# Altium schematic sheet Sheet1.SchDoc
size A4; SheetNumber: 1; SheetTotal: 2
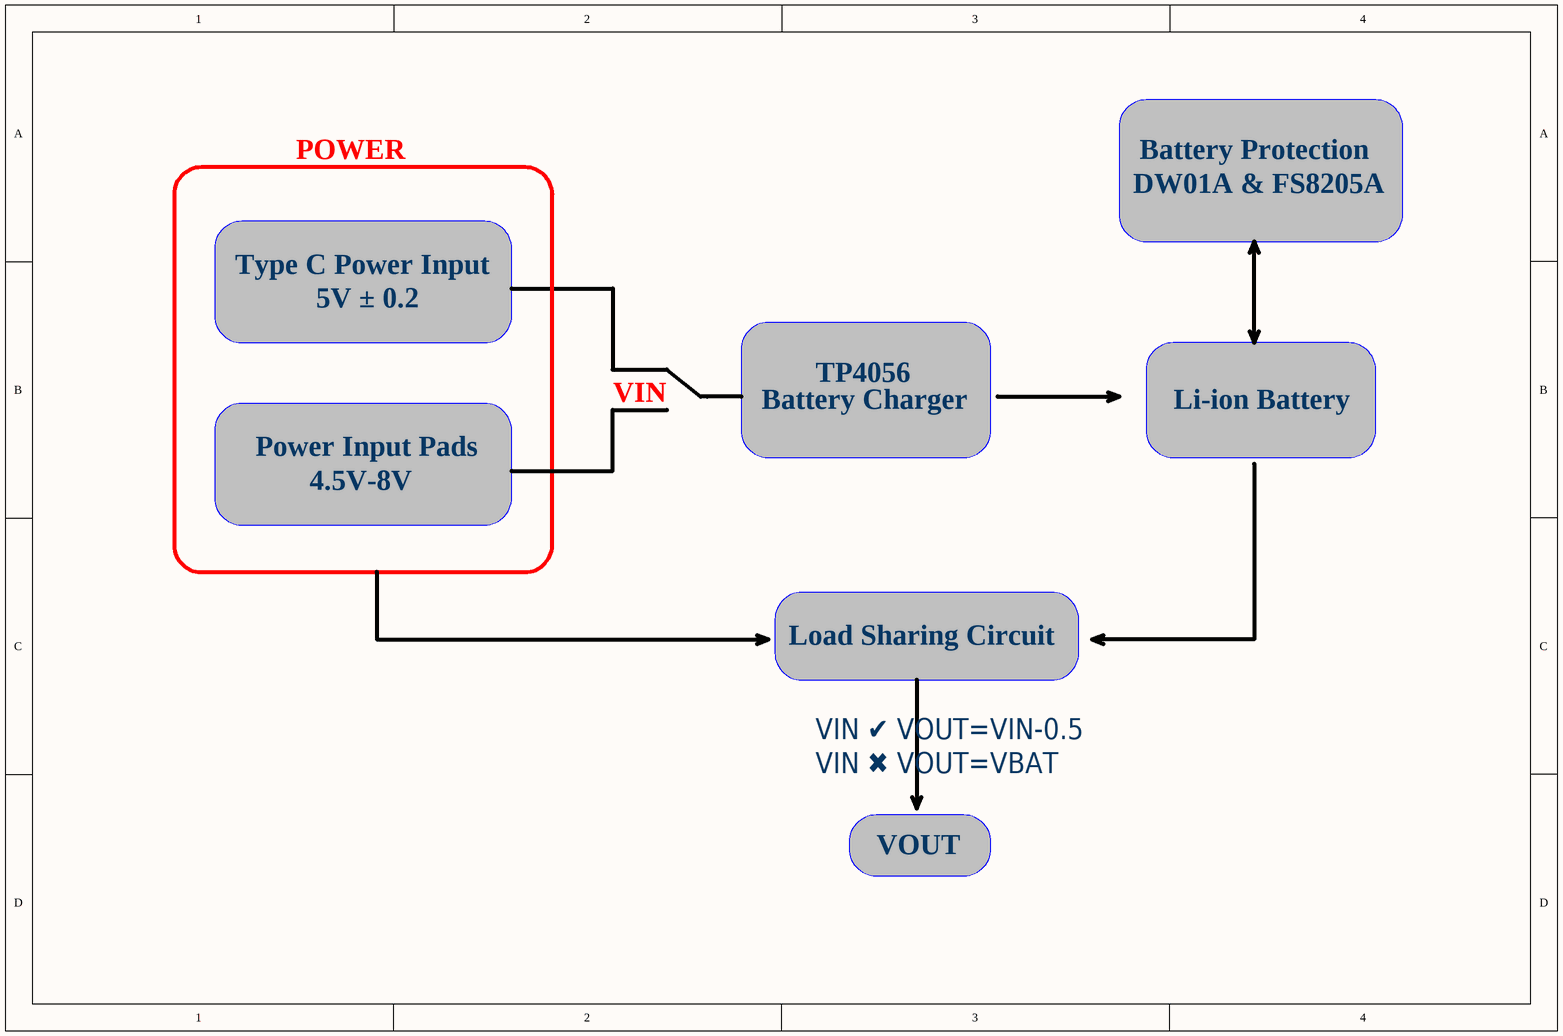
[diagram p0: Sheet1.SchDoc]

## Notes on the sheet
- POWER
- Battery Protection
- DW01A & FS8205A
- Type C Power Input
- 5V ± 0.2
- TP4056
- VIN
- Battery Charger
- Li-ion Battery
- Power Input Pads
- 4.5V-8V
- Load Sharing Circuit
- VIN ✔ VOUT=VIN-0.5
- VIN ✖ VOUT=VBAT
- VOUT